# Altium schematic sheet MMC_2_2_Ethernet.SchDoc
size A4
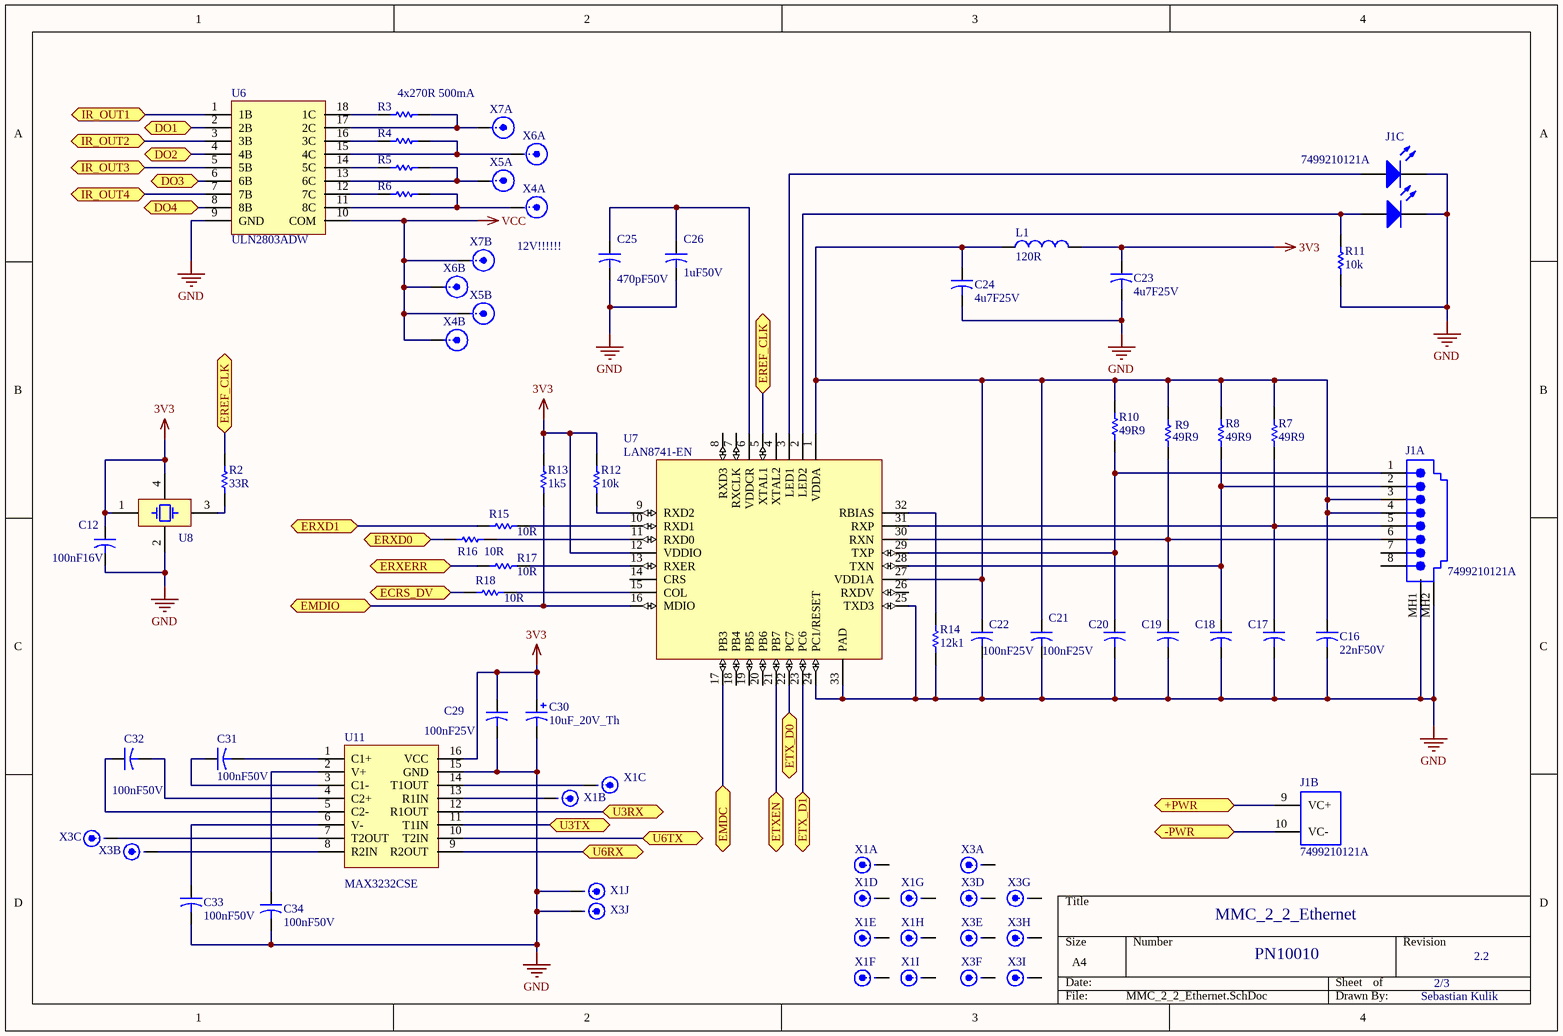
[diagram p0: MMC_2_2_Ethernet.SchDoc]

## Parts
C12  value 100nF16V  [C0402]  (hidden comment: 100nF16V_0402)
C16  value 22nF50V  [C0603]  (hidden comment: 22nF50V_0603)
C17  10pF50V_0603  [C0603]  (value not drawn)
C18  10pF50V_0603  [C0603]  (value not drawn)
C19  10pF50V_0603  [C0603]  (value not drawn)
C20  10pF50V_0603  [C0603]  (value not drawn)
C21  value 100nF25V  [C0402]  (hidden comment: 100nF25V_0402)
C22  value 100nF25V  [C0402]  (hidden comment: 100nF25V_0402)
C23  value 4u7F25V  [C0805]  (hidden comment: 4u7F25V_0805)
C24  value 4u7F25V  [C0805]  (hidden comment: 4u7F25V_0805)
C25  value 470pF50V  [C0402]  (hidden comment: 470pF50V_0402)
C26  value 1uF50V  [C0603]  (hidden comment: 1uF50V_0603)
C29  value 100nF25V  [C0402]  (hidden comment: 100nF25V_0402)
C30  value 10uF_20V_Th  [Vishay293D-B]  (hidden comment: 10uF_20V_V293D-B)
C31  value 100nF50V  [C0402]  (hidden comment: 100n50V_0402)
C32  value 100nF50V  [C0402]  (hidden comment: 100n50V_0402)
C33  value 100nF50V  [C0402]  (hidden comment: 100n50V_0402)
C34  value 100nF50V  [C0402]  (hidden comment: 100n50V_0402)
J1  7499210121A  [7499210121A]  (parts A,B,C of 3)
L1  value 120R  [L0603]  (hidden comment: 120R4A_0603)
R2  value 33R  [R0402]  (hidden comment: 33R_0402)
R3  270R_1210  [R1210_N]  (value not drawn)
R4  270R_1210  [R1210_N]  (value not drawn)
R5  270R_1210  [R1210_N]  (value not drawn)
R6  270R_1210  [R1210_N]  (value not drawn)
R7  value 49R9  [R0402]  (hidden comment: 49R9_0402)
R8  value 49R9  [R0402]  (hidden comment: 49R9_0402)
R9  value 49R9  [R0402]  (hidden comment: 49R9_0402)
R10  value 49R9  [R0402]  (hidden comment: 49R9_0402)
R11  value 10k  [R0402]  (hidden comment: 10k_0402)
R12  value 10k  [R0402]  (hidden comment: 10k_0402)
R13  value 1k5  [R0402]  (hidden comment: 1k5_0402)
R14  value 12k1  [R0603(1608)]  (hidden comment: 12k1_0603)
R15  value 10R  [R0402]  (hidden comment: 10R_0402)
R16  value 10R  [R0402]  (hidden comment: 10R_0402)
R17  value 10R  [R0402]  (hidden comment: 10R_0402)
R18  value 10R  [R0402]  (hidden comment: 10R_0402)
U6  ULN2803ADW  [SOIC18-WIDE]
U7  LAN8741-EN  [32M1-A_M]
U8  TXC-7W-50.000MBB-T  [TXC_7W]  (value not drawn)
U11  MAX3232CSE  [SOIC16_L]
X1  SUB-D_9  [M09HP]  (value not drawn)  (parts A,B,C,D,E,F,G,H,I,J of 10)
X3  SUB-D_9  [M09HP]  (value not drawn)  (parts A,B,C,D,E,F,G,H,I,J of 10)
X4  PhoenixMSTBA-2  [MSTBA 2,5_2-G-5,08-LR]  (value not drawn)  (parts A,B of 2)
X5  PhoenixMSTBA-2  [MSTBA 2,5_2-G-5,08-LR]  (value not drawn)  (parts A,B of 2)
X6  PhoenixMSTBA-2  [MSTBA 2,5_2-G-5,08-LR]  (value not drawn)  (parts A,B of 2)
X7  PhoenixMSTBA-2  [MSTBA 2,5_2-G-5,08-LR]  (value not drawn)  (parts A,B of 2)

## Ports
+PWR, -PWR, DO1, DO2, DO3, DO4, ECRS_DV, EMDC, EMDIO, EREF_CLK, ERXD0, ERXD1, ERXERR, ETX_D0, ETX_D1, ETXEN, IR_OUT1, IR_OUT2, IR_OUT3, IR_OUT4, U3RX, U3TX, U6RX, U6TX

## Nets
3V3: C12.1 C23.1 C29.1 C30.1 L1.2 R12.2 R13.2 U7.12(VDDIO) U8.1(E/D) U8.4(VCC) U11.16(VCC)
GND: C12.2 C16.2 C17.2 C18.2 C19.2 C20.2 C21.2 C22.2 C23.2 C24.2 C25.2 C26.2 C29.2 C30.2 C33.2 C34.2 J1.12(K) J1.14(K) J1.MH1(Shield) J1.MH2(Shield) R11.1 R14.1 U6.9(GND) U7.24(PC1/RESET) U7.25(TXD3) U7.33(PAD) U8.2(GND) U11.15(GND) X1.10(GND) X3.10(GND)
VCC: U6.10(COM) X4.2(Y) X5.2(Y) X6.2(Y) X7.2(Y)
+PWR: J1.9(VC+) ; port +PWR
-PWR: J1.10(VC-) ; port -PWR
DO1: U6.2(2B) ; port DO1
DO2: U6.4(4B) ; port DO2
DO3: U6.6(6B) ; port DO3
DO4: U6.8(8B) ; port DO4
ECRS_DV: R18.2 ; port ECRS_DV
EMDC: U7.17(PB3) ; port EMDC
EMDIO: R13.1 U7.16(MDIO) ; port EMDIO
EREF_CLK: R2.2 U7.5(XTAL1) ; port EREF_CLK
ERXD0: R16.2 ; port ERXD0
ERXD1: R15.2 ; port ERXD1
ERXERR: R17.2 ; port ERXERR
ETX_D0: U7.22(PC7) ; port ETX_D0
ETX_D1: U7.23(PC6) ; port ETX_D1
ETXEN: U7.21(PB7) ; port ETXEN
IR_OUT1: U6.1(1B) ; port IR_OUT1
IR_OUT2: U6.3(3B) ; port IR_OUT2
IR_OUT3: U6.5(5B) ; port IR_OUT3
IR_OUT4: U6.7(7B) ; port IR_OUT4
U3RX: U11.12(R1OUT) ; port U3RX
U3TX: U11.11(T1IN) ; port U3TX
U6RX: U11.9(R2OUT) ; port U6RX
U6TX: U11.10(T2IN) ; port U6TX
NetC16_1: C16.1 C21.1 C22.1 C24.1 J1.3 J1.4 L1.1 R7.2 R8.2 R9.2 R10.2 U7.1(VDDA) U7.27(VDD1A)
NetC17_1: C17.1 J1.5 R7.1 U7.31(RXP)
NetC18_1: C18.1 J1.2 R8.1 U7.28(TXN)
NetC19_1: C19.1 J1.6 R9.1 U7.30(RXN)
NetC20_1: C20.1 J1.1 R10.1 U7.29(TXP)
NetC25_1: C25.1 C26.1 U7.6(VDDCR)
NetC31_1: C31.1 U11.3(C1-)
NetC31_2: C31.2 U11.1(C1+)
NetC32_1: C32.1 U11.5(C2-)
NetC32_2: C32.2 U11.4(C2+)
NetC33_1: C33.1 U11.6(V-)
NetC34_1: C34.1 U11.2(V+)
NetJ1_11: J1.11(A) U7.3(LED1)
NetJ1_13: J1.13(A) R11.2 U7.2(LED2)
NetR2_1: R2.1 U8.3(OSC2)
NetR3_1: R3.1 U6.18(1C)
NetR3_2: R3.2 U6.17(2C) X7.1(X)
NetR4_1: R4.1 U6.16(3C)
NetR4_2: R4.2 U6.15(4C) X6.1(X)
NetR5_1: R5.1 U6.14(5C)
NetR5_2: R5.2 U6.13(6C) X5.1(X)
NetR6_1: R6.1 U6.12(7C)
NetR6_2: R6.2 U6.11(8C) X4.1(X)
NetR12_1: R12.1 U7.9(RXD2)
NetR14_2: R14.2 U7.32(RBIAS)
NetR15_1: R15.1 U7.10(RXD1)
NetR16_1: R16.1 U7.11(RXD0)
NetR17_1: R17.1 U7.13(RXER)
NetR18_1: R18.1 U7.15(COL)
NetU11_7: U11.7(T2OUT) X3.3
NetU11_8: U11.8(R2IN) X3.2
NetU11_13: U11.13(R1IN) X1.2
NetU11_14: U11.14(T1OUT) X1.3

Not connected (* = marked no-connect by the designer): J1 7 8; U7 4(XTAL2) 7(RXCLK) 8(RXD3) 14(CRS) 18(PB4) 19(PB5) 20(PB6) 26(RXDV); X1 1 4 5 6 7 8 9; X3 1 4 5 6 7 8 9

## Notes on the sheet
- (near R3) 4x270R 500mA
- 12V!!!!!!
- MMC_2_2_Ethernet
- PN10010
- 2/3
- 2.2
- Sebastian Kulik

## Library data of the parts
C12 = 100nF16V_0402: Capacitor; Part Description: TDK. CGA series, X7R, 10%, 16V; Deliverer PartNr: 2210748RL; Manufacturer: TDK; Manufacturer PartNr: CGA2B1X7R1C104K050BC; Deliverer: Farnell; TDFE-PN: C0025; Published: 12.02.2014; Publisher: Sebastian Kulik; PackageDescription: C0403
C16 = 22nF50V_0603: AVX ,  X7R, 5%, 50V; Deliverer PartNr: 2332645RL; Manufacturer PartNr: 06035C223JAT2A; Deliverer: Farnell; TDFE-PN: C0034; Published: 13.02.2014; Part Description: AVX ,  X7R, 5%, 50V; Publisher: Sebastian Kulik; PackageDescription: C0603; Manufacturer: AVX
C17-C20 = 10pF50V_0603: AVX ,  +-0.5pF, 50V; Deliverer PartNr: 2332595RL; Manufacturer PartNr: 06035A100DAT2A; Deliverer: Farnell; TDFE-PN: C0033; Published: 13.02.2014; Part Description: AVX ,  +-0.5pF, 50V; Publisher: Sebastian Kulik; PackageDescription: C0603; Manufacturer: AVX; Value: 10pF50V
C21 C22 C29 = 100nF25V_0402: AVX, X5R, 10%, 25V; Deliverer PartNr: 2280767; Manufacturer PartNr: 04023D104KAT2A; Deliverer: Farnell; TDFE-PN: C0036; Published: 13.02.2014; Part Description: AVX, X5R, 10%, 25V; Publisher: Sebastian Kulik; PackageDescription: C0403; Manufacturer: AVX
C23 C24 = 4u7F25V_0805: TDK  C series, X7R, 10%, 25V; Deliverer PartNr: 2346943RL; Manufacturer PartNr: C2012X7R1E475K125AB; Deliverer: Farnell; TDFE-PN: C0035; Published: 13.02.2014; Part Description: TDK  C series, X7R, 10%, 25V; Publisher: Sebastian Kulik; PackageDescription: C0805; Manufacturer: TDK
C25 = 470pF50V_0402: AVX, 50V; Deliverer PartNr: 1657927; Manufacturer PartNr: 04025A471JAT2A; Deliverer: Farnell; TDFE-PN: C0030; Published: 13.02.2014; Part Description: AVX,50V; Publisher: Sebastian Kulik; PackageDescription: C0403; Manufacturer: AVX
C26 = 1uF50V_0603: C series, X5R, 10%; Deliverer PartNr: 2211179RL; Manufacturer: TDK; Manufacturer PartNr: C1608X5R1H105K080AB; Deliverer: Farnell; TDFE-PN: C0037; Published: 13.02.2014; Part Description: C series, X5R, 10%; Publisher: Sebastian Kulik; PackageDescription: C0603
C30 = 10uF_20V_V293D-B: 293 series, tantal, 10%, 10V; Part Description: 293 series, tantal, 10%, 20V; Deliverer PartNr: 1754203; Manufacturer: Vishay; Manufacturer PartNr: 293D106X9020B2TE3; Deliverer: Farnell; TDFE-PN: C0043; Published: 14.03.2014; Publisher: Sebastian Kulik; PackageDescription: Vishay-293D-B
C31-C34 = 100n50V_0402: C series, X5R, 10%, 50V; Deliverer PartNr: 2354078; Manufacturer: TDK; Manufacturer PartNr: C1005X5R1H104K050BB; Deliverer: Farnell; TDFE-PN: C0044; Published: 13.02.2014; Part Description: C series, X5R, 10%, 50V; Publisher: Sebastian Kulik; PackageDescription: C0403
J1 = Ethernet, POE, WE7499210121A: Modular Jack , Right Angle RJ-45, Low Profile; Deliverer PartNr: 1636396; Manufacturer: Wuerth Elektronik; Ports: 1; PCB_Mounting: Thru-Hole; Deliverer: Farnell; TDE-PN: CON0005; PackageReference: 7499210121A; Publisher: Sebastian Kulik; Manufacturer PartNr: 7499210121A
L1 = 120R4A_0603: Murata, Ferrit, 120Rx2A; Deliverer PartNr: 1515738RL; Manufacturer PartNr: BLM18PG121SN1D; Deliverer: Farnell; TDE-PN: P0016; Manufacturer: Murata; Published: 13.02.2014; Publisher: Sebastian Kulik
R2 = 33R_0402: Vishay CRCW series, 63mW, 1%; Manufacturer PartNr: CRCW040233R0FKEAHP; Deliverer PartNr: 1738830; TDE-PN: R0037; Deliverer: Farnell; Published: 12.02.2014; PackageReference: 0402; Publisher: Sebastian Kulik; PackageDescription: 0402; Manufacturer: Vishay; Part Description: Vishay CRCW series, 63mW, 1%
R3-R6 = 270R_1210: ERJ series, 500mW, 5%; Manufacturer: Panasonic; Manufacturer PartNr: ERJ14YJ271U; Deliverer PartNr: 2324044; TDE-PN: R0042; Deliverer: Farnell; Value: 270R; Published: 13.03.2014; PackageReference: 1210; Publisher: Sebastian Kulik; PackageDescription: 1210; Part Description: ERJ series, 500mW, 5%
R7-R10 = 49R9_0402: Vishay CRCW series, 63mW, 1%; Manufacturer PartNr: CRCW040249R9FKED; Deliverer PartNr: 2121437; TDE-PN: R0035; Deliverer: Farnell; Published: 13.02.2014; PackageReference: 0402; Publisher: Sebastian Kulik; PackageDescription: 0402; Manufacturer: Vishay; Part Description: Vishay CRCW series, 63mW, 1%
R11 R12 = 10k_0402: Vishay CRCW series, 125mW, 1%; Manufacturer PartNr: CRCW040210K0FKEAHP; Deliverer PartNr: 1738864; TDE-PN: R0012; Deliverer: Farnell; Published: 12.02.2014; PackageReference: 0402; Publisher: Sebastian Kulik; PackageDescription: 0402; Manufacturer: Vishay; Part Description: Vishay CRCW series, 125mW, 1%
R13 = 1k5_0402: Vishay CRCW series, 125mW, 1%; Manufacturer PartNr: CRCW04021K50FKEAHP; Deliverer PartNr: 1738852; Part Description: Vishay CRCW series, 63mW, 1%; TDE-PN: R0036; Deliverer: Farnell; Published: 13.02.2014; PackageReference: 0402; Publisher: Sebastian Kulik; PackageDescription: 0402; Manufacturer: Vishay
R14 = 12k1_0603: Vishay, CRCW series, 100mW, 1%; Manufacturer PartNr: CRCW060312K1FKEA; Deliverer PartNr: 2122502; TDE-PN: R0037; Deliverer: Farnell; Published: 11.02.2014; Publisher: Sebastian Kulik; PackageDescription: 0603; Manufacturer: Vishay; Part Desicription: Vishay, CRCW series, 100mW, 1%
R15-R18 = 10R_0402: Vishay CRCW series, 125mW, 1%; Manufacturer PartNr: CRCW040210R0FKEAHP; Deliverer PartNr: 1738824RL; TDE-PN: R0015; Deliverer: Farnell; Published: 12.02.2014; PackageReference: 0402; Publisher: Sebastian Kulik; PackageDescription: 0402; Manufacturer: Vishay; Part Description: Vishay CRCW series, 125mW, 1%
U6 = ULN2803ADW: Darlington array, 50V; Deliverer PartNr: 1652419; Manufacturer: TI; Deliverer: Farnell; TDE-PN: IC0043; Published: 13.03.2014; PackageReference: TSSOP18; Publisher: Sebastian Kulik; Manufacturer PartNr: ULN2803ADW
U7 = LAN8741-EN: Ethernet Phy; Deliverer PartNr: 2373284; Manufacturer PartNr: LAN8741A-EN; Manufacturer: Microchip; TDE-PN: IC0036; Deliverer: Farnell; Published: 12.02.2014; LatestRevisionNote: IPC-7351 Footprint Added.; Publisher: Sebastian Kulik
U8 = TXC-7W-50.000MBB-T: Crystal; Deliverer PartNr: 1842144; Manufacturer: TXC; Deliverer: Farnell; TDE-PN: IC0037; Published: 17.02.2014; PackageReference: SOT23; Publisher: Sebastian Kulik; Manufacturer PartNr: 7W-50.000MBB-T
U11 = MAX3232CSE: RS232 transceiver; Deliverer PartNr: 9725490; Manufacturer PartNr: MAX3232CSE+; Manufacturer: Maxim; Deliverer: Farnell; TDE-PN: IC0044; Published: 14.03.2014; PackageReference: TSSOP16; Publisher: Sebastian Kulik
X1 X3 = SUB-D_9: Deliverer PartNr: 8391246; Manufacturer PartNr: 1-1634580-2; Manufacturer: AMP; Deliverer: Farnell; TDE-PN: CON0007; LatestRevisionDate: 14.03.2014; LatestRevisionNote: Re-released for DXP Platform.; Publisher: Sebastian Kulik
X4-X7 = PhoenixMSTBA-2: Deliverer PartNr: 2315182; Manufacturer PartNr: MSTBA 2,5/ 2-G-5,08-LR; Manufacturer: Phoenix Contact; Deliverer: Farnell; TDE-PN: CON0006; LatestRevisionDate: 13.03.2014; LatestRevisionNote: Re-released for DXP Platform.; Publisher: Sebastian Kulik